# Altium schematic sheet Cover page - Project Log.SchDoc
size A
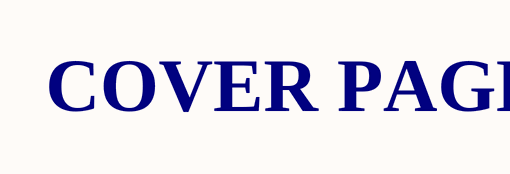
[diagram p0: Cover page - Project Log.SchDoc]

## Notes on the sheet
- COVER PAGE